# Altium project imu_evo.PrjPCB
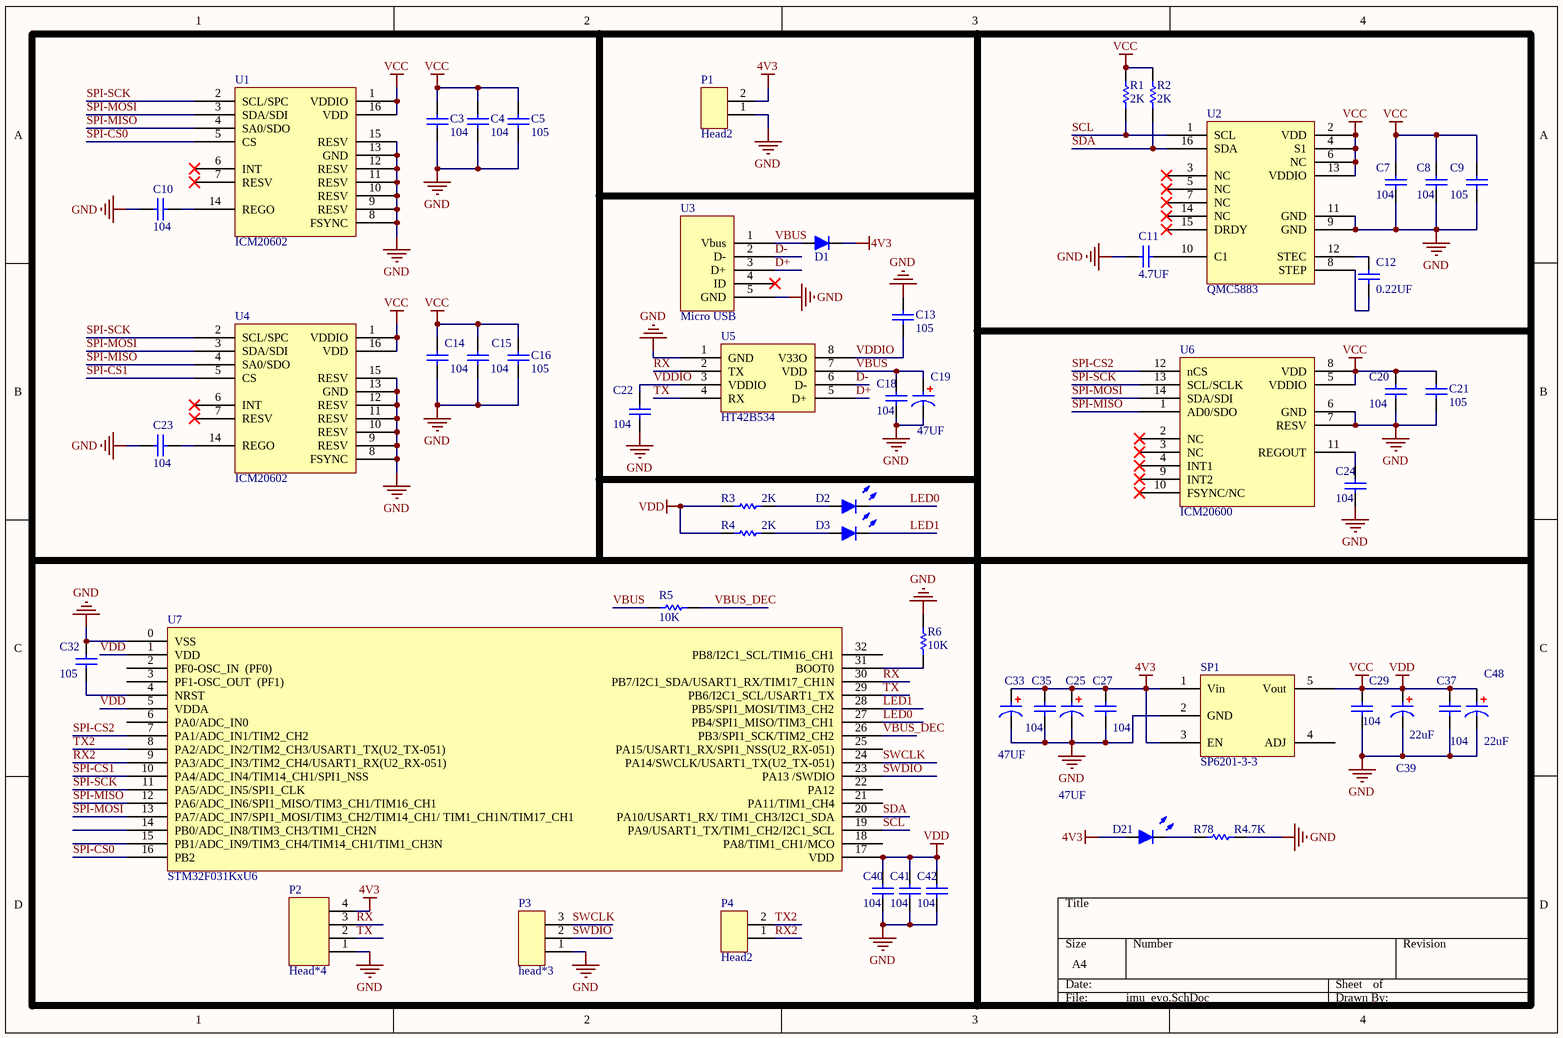
[diagram p0: imu_evo.SchDoc]
1 sheet, 55 parts. Net scope: global (net labels, ports and power ports of the same name join across sheets).
Board file: imu_evo.PcbDoc

## Sheet imu_evo.SchDoc
size A4

### Parts
C3  104  [0402]
C4  104  [0402]
C5  C1uF  [0603C]  (value not drawn)
C7  104  [0402]
C8  104  [0402]
C9  C1uF  [0603C]  (value not drawn)
C10  104  [0402]
C11  4.7UF  [0603C]
C12  0.22UF  [0402]
C13  105  [0603C]
C14  104  [0402]
C15  104  [0402]
C16  C1uF  [0603C]  (value not drawn)
C18  104  [0402]
C19  47UF  [1206]
C20  104  [0402]
C21  C1uF  [0603C]  (value not drawn)
C22  104  [0402]
C23  104  [0402]
C24  104  [0402]
C25  47UF  [1206]
C27  104  [0603C]
C29  104  [0402]
C32  C1uF  [0603C]  (value not drawn)
C33  47UF  [1206]
C35  104  [0603C]
C37  104  [0402]
C39  22uF  [0603C]
C40  104  [0402]
C41  104  [0402]
C42  104  [0402]
C48  22uF  [0603C]
D1  BAT54WS  [LC-SOD-323F]  (value not drawn)
D2  LED-G  [LED]  (value not drawn)
D3  LED-B  [LED]  (value not drawn)
D21  LED-R  [LED]  (value not drawn)
P1  Head2  [HEAD2]
P2  Head*4  [B2BC-1.0-4P]
P3  head*3  [head*3 - duplicate]
P4  Head2  [HEAD2]
R1  R2K  [0402]  (value not drawn)
R2  R2K  [0402]  (value not drawn)
R3  R2K  [0402]  (value not drawn)
R4  R2K  [0402]  (value not drawn)
R5  R10K  [0402]  (value not drawn)
R6  R10K  [0402]  (value not drawn)
R78  R4.7K  [0402]
SP1  SP6201-3-3  [SOT23-5]
U1  ICM20602  [LGA16]
U2  QMC5883  [LGA16-Quad]
U3  Micro USB  [Micro_USB_t]
U4  ICM20602  [LGA16]
U5  HT42B534  [SOP-8]
U6  ICM20600  [LGA14]
U7  STM32F031KxU6  [QFN32]

### Nets
4V3: C25.1 C27.2 C33.1 C35.2 D1.2(K) D21.1(A) P1.2 P2.4 SP1.1(Vin) SP1.3(EN)
GND: C3.2 C4.2 C5.1 C7.2 C8.2 C9.1 C10.1 C11.2 C13.1 C14.2 C15.2 C16.1 C18.2 C19.2 C20.2 C21.1 C22.2 C23.1 C24.2 C25.2 C27.1 C29.1 C32.1 C33.2 C35.1 C37.1 C39.2 C40.2 C41.2 C42.2 C48.2 P1.1 P2.1 P3.1 R6.2 R78.2 SP1.2(GND) U1.8(FSYNC) U1.9(RESV) U1.10(RESV) U1.11(RESV) U1.12(RESV) U1.13(GND) U1.15(RESV) U2.9(GND) U2.11(GND) U3.5(GND) U4.8(FSYNC) U4.9(RESV) U4.10(RESV) U4.11(RESV) U4.12(RESV) U4.13(GND) U4.15(RESV) U5.1(GND) U6.6(GND) U6.7(RESV) U7.0(VSS)
VDD: C3.1 C4.1 C5.2 C7.1 C8.1 C9.2 C14.1 C15.1 C16.2 C20.1 C21.2 C29.2 C37.2 C39.1 C40.1 C41.1 C42.1 C48.1 R1.2 R2.2 R3.1 R4.1 SP1.5(Vout) U1.1(VDDIO) U1.16(VDD) U2.2(VDD) U2.4(S1) U2.6(NC) U2.13(VDDIO) U4.1(VDDIO) U4.16(VDD) U6.5(VDDIO) U6.8(VDD) U7.1(VDD) U7.5(VDDA) U7.17(VDD)  [also labelled VCC]
D+: U3.3(D+) U5.5(D+)
D-: U3.2(D-) U5.6(D-)
LED0: D2.2(K) U7.27(PB4/SPI1_MISO/TIM3_CH1)
LED1: D3.2(K) U7.28(PB5/SPI1_MOSI/TIM3_CH2)
RX: P2.3 U5.2(TX) U7.30(PB7/I2C1_SDA/USART1_RX/TIM17_CH1N)
RX2: P4.1 U7.9(PA3/ADC_IN3/TIM2_CH4/USART1_RX(U2_RX-051))
SCL: R1.1 U2.1(SCL) U7.19(PA9/USART1_TX/TIM1_CH2/I2C1_SCL)
SDA: R2.1 U2.16(SDA) U7.20(PA10/USART1_RX/_TIM1_CH3/I2C1_SDA)
SPI-CS0: U1.5(CS) U7.16(PB2)
SPI-CS1: U4.5(CS) U7.10(PA4/ADC_IN4/TIM14_CH1/SPI1_NSS)
SPI-CS2: U6.12(nCS) U7.7(PA1/ADC_IN1/TIM2_CH2)
SPI-MISO: U1.4(SA0/SDO) U4.4(SA0/SDO) U6.1(AD0/SDO) U7.12(PA6/ADC_IN6/SPI1_MISO/TIM3_CH1/TIM16_CH1)
SPI-MOSI: U1.3(SDA/SDI) U4.3(SDA/SDI) U6.14(SDA/SDI) U7.13(PA7/ADC_IN7/SPI1_MOSI/TIM3_CH2/TIM14_CH1/_TIM1_CH1N/TIM17_CH1)
SPI-SCK: U1.2(SCL/SPC) U4.2(SCL/SPC) U6.13(SCL/SCLK) U7.11(PA5/ADC_IN5/SPI1_CLK)
SWCLK: P3.3 U7.24(PA14/SWCLK/USART1_TX(U2_TX-051))
SWDIO: P3.2 U7.23(PA13_/SWDIO)
TX: P2.2 U5.4(RX) U7.29(PB6/I2C1_SCL/USART1_TX)
TX2: P4.2 U7.8(PA2/ADC_IN2/TIM2_CH3/USART1_TX(U2_TX-051))
VBUS: C18.1 C19.1 D1.1(A) R5.2 U3.1(Vbus) U5.7(VDD)
VBUS_DEC: R5.1 U7.26(PB3/SPI1_SCK/TIM2_CH2)
VDDIO: C13.2 C22.1 U5.3(VDDIO) U5.8(V33O)
NetC10_2: C10.2 U1.14(REGO)
NetC11_1: C11.1 U2.10(C1)
NetC12_1: C12.1 U2.12(STEC)
NetC12_2: C12.2 U2.8(STEP)
NetC23_2: C23.2 U4.14(REGO)
NetC24_1: C24.1 U6.11(REGOUT)
NetC32_2: C32.2 U7.4(NRST)
NetD2_1: D2.1(A) R3.2
NetD3_1: D3.1(A) R4.2
NetD21_2: D21.2(K) R78.1
NetR6_1: R6.1 U7.31(BOOT0)

Not connected (* = marked no-connect by the designer): SP1 4(ADJ); U1 6(INT)* 7(RESV)*; U2 3(NC)* 5(NC)* 7(NC)* 14(NC)* 15(DRDY)*; U3 0(SHELL) 4(ID)*; U4 6(INT)* 7(RESV)*; U6 2(NC)* 3(NC)* 4(INT1)* 9(INT2)* 10(FSYNC/NC)*; U7 2(PF0-OSC_IN__(PF0)) 3(PF1-OSC_OUT__(PF1)) 6(PA0/ADC_IN0) 14(PB0/ADC_IN8/TIM3_CH3/TIM1_CH2N) 15(PB1/ADC_IN9/TIM3_CH4/TIM14_CH1/TIM1_CH3N) 18(PA8/TIM1_CH1/MCO) 21(PA11/TIM1_CH4) 22(PA12) 25(PA15/USART1_RX/SPI1_NSS(U2_RX-051)) 32(PB8/I2C1_SCL/TIM16_CH1)

### Notes on the sheet
- (in symbol C0.1uF) 105
- (in symbol R10K) 10K; 2K

### Library data of the parts
C3-C5 C7-C16 C18 C20-C24 C27 C29 C32 C35 C37 C40-C42 = C0.1uF
C19 C25 C33 C39 C48 = C100uF
D1 = Diode
D2 D3 D21 = LED
R1-R4 R78 = R10K
SP1 = SP6201
U3 = MINI USB